# Altium schematic sheet Output.Schematic.SchDoc
size A
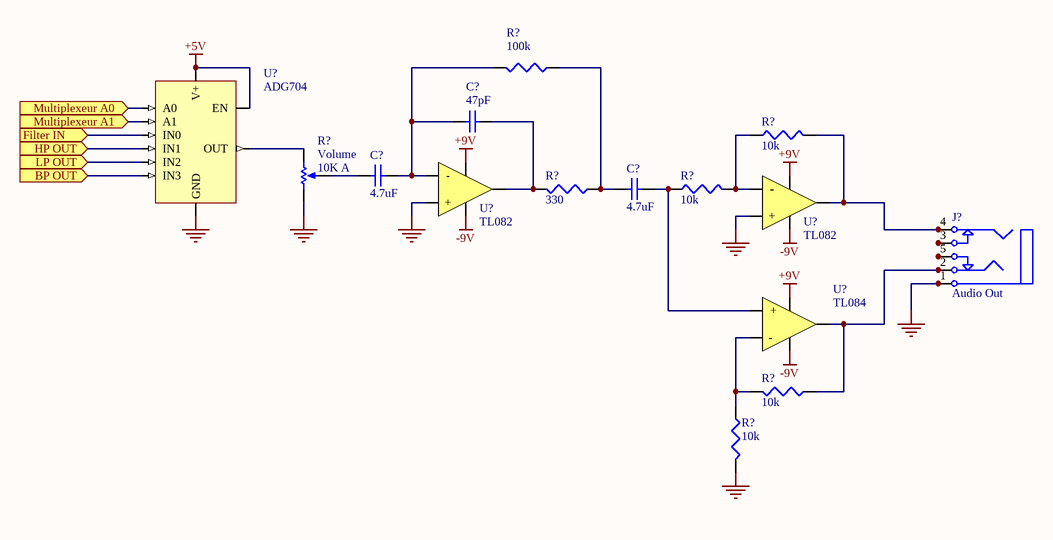
[diagram p0: Output.Schematic.SchDoc]

## Parts
(Parts that share a designator on the sheet are numbered #1, #2 ... from top to bottom, then left to right.)
C?#1  47pF  [C1206]
C?#2  4.7uF  [C1206]
C?#3  4.7uF  [C1206]
J?  Audio Out  [ST-3150-5N]
R?#1  100k  [J1-0603]
R?#2  10k  [J1-0603]
R?#3  10k  [J1-0603]
R?#4  Volume  value 10K A  [VR5]
R?#5  330  [J1-0603]
R?#6  10k  [J1-0603]
R?#7  10k  [J1-0603]
U?#1  ADG704
U?#2  TL082
U?#3  TL082
U?#4  TL084

## Ports
BP OUT (in), Filter IN (in), HP OUT (in), LP OUT (in), Multiplexeur A0 (in), Multiplexeur A1 (in)

## Nets
+5V: U?#1.5(EN) U?#1.6(V+)
+9V: U?#2.8(VCC+) U?#3.8(VCC+) U?#4.4(VCC+)
-9V: U?#2.4(VCC-) U?#3.4(VCC-) U?#4.11(VCC-)
GND: J?.1 J?.1A J?.1B R?#4.1(TOP) R?#7.2 U?#1.3(GND) U?#2.3(+) U?#3.3(+)
BP OUT: U?#1.7(IN3) ; port BP OUT
Filter IN: U?#1.2(IN0) ; port Filter IN
HP OUT: U?#1.9(IN1) ; port HP OUT
LP OUT: U?#1.4(IN2) ; port LP OUT
Multiplexeur A0: U?#1.1(A0) ; port Multiplexeur A0
Multiplexeur A1: U?#1.10(A1) ; port Multiplexeur A1
NetC?#1_1: C?#1.1 C?#2.2 R?#1.2 U?#2.2(-)
NetC?#1_2: C?#1.2 R?#5.2 U?#2.1(OUT)
NetC?#2_1: C?#2.1 R?#4.3(TAP)
NetC?#3_1: C?#3.1 R?#1.1 R?#5.1
NetC?#3_2: C?#3.2 R?#3.1 U?#4.2(+)
NetJ?_2: J?.2 J?.2A J?.2B R?#6.1 U?#4.1(OUT)
NetJ?_3: J?.3 J?.3A J?.3B
NetJ?_4: J?.4 J?.4A J?.4B R?#2.2 U?#3.1(OUT)
NetJ?_5: J?.5 J?.5A J?.5B
NetR?#2_1: R?#2.1 R?#3.2 U?#3.2(-)
NetR?#4_2: R?#4.2(BOT) U?#1.8(OUT)
NetR?#6_2: R?#6.2 R?#7.1 U?#4.3(-)

## Library data of the parts
C?#1 = Cap Semi: Capacitor (Semiconductor SIM Model); Published: 8-Jun-2000; LatestRevisionDate: 29-May-2009; LatestRevisionNote: IPC-7351 Footprint Added.; PackageReference: C1206; Publisher: Altium Limited; PackageDescription: Chip Capacitor; Value: 47pF
C?#2 C?#3 = Cap Semi: Capacitor (Semiconductor SIM Model); Value: 4.7u; Published: 8-Jun-2000; LatestRevisionDate: 29-May-2009; LatestRevisionNote: IPC-7351 Footprint Added.; PackageReference: C1206; Publisher: Altium Limited; PackageDescription: Chip Capacitor
J? = Phonejack Stereo SW: 3-Conductor Jack with 2 break contacts (normals) and 2 auxiliary make contacts; Published: 5-Jan-2004; LatestRevisionDate: 17-Dec-2003; LatestRevisionNote: PCB Footprint replaced.; DatasheetDocument: 07-Mar-2000; Publisher: Altium Limited; ComponentLink1Description: Manufacturer Link; ComponentLink1URL: http://domino.kycon.com/internet/Products.html
R?#1-R?#3 R?#5-R?#7 = Res3: Resistor; Published: 8-Jun-2000; LatestRevisionDate: 29-May-2009; LatestRevisionNote: IPC-7351 Footprint Added.; PackageReference: J1-0603; Publisher: Altium Limited; PackageDescription: Chip Resistor
  R?#1: Value: 100K
  R?#2 R?#3 R?#6 R?#7: Value: 10K
  R?#5: Value: 330
R?#4 = RPot: Potentiometer; Sim Note: Enter the Resistance value and the set point into parameter fields.; Set Position: 0.5; Published: 8-Jun-2000; LatestRevisionDate: 17-Jul-2002; LatestRevisionNote: Re-released for DXP Platform.; PackageReference: VR5; Publisher: Altium Limited; PackageDescription: Variable Resistor, Thru-Hole; 3 Leads